# Altium project Keda.PrjPcb
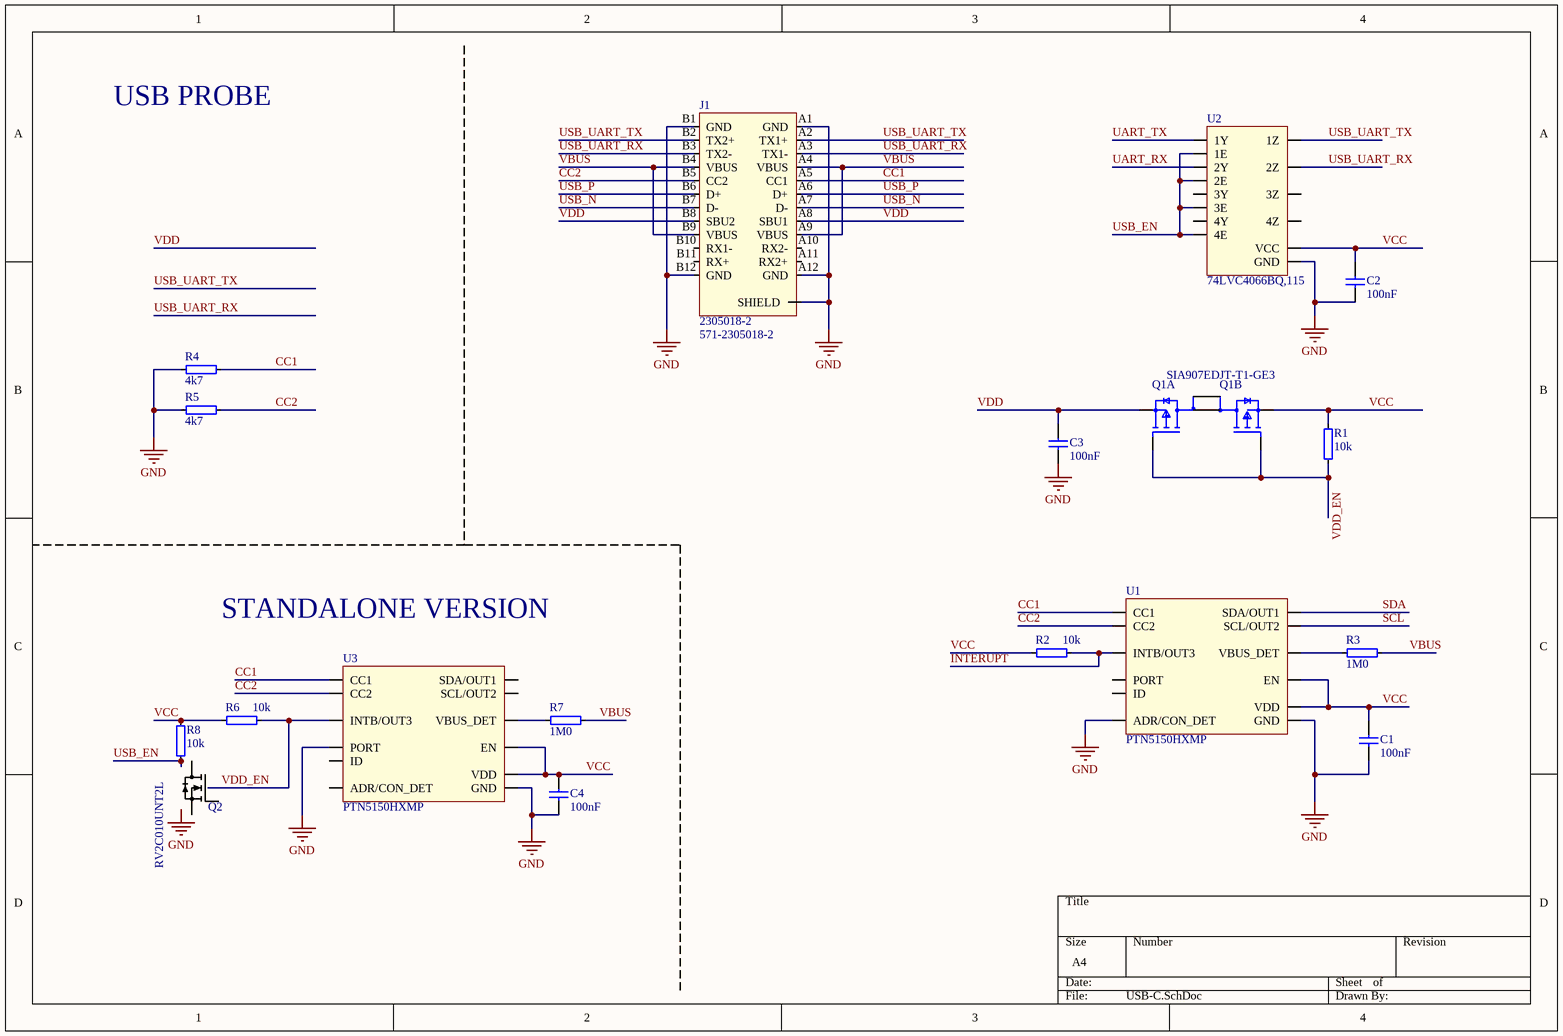
[diagram p0: USB-C.SchDoc]
3 sheets, 60 parts. Net scope: flat (ports and power ports of the same name join across sheets).
Board file: FPC.PcbDoc
Sheets:
  USB-C.SchDoc
  e-ink_display.SchDoc
  LTC3554.SchDoc

## Sheet USB-C.SchDoc
size A4; SheetNumber: 1; SheetTotal: 4

### Parts
C1  100nF  [CAPC0603X03L_C]
C2  100nF  [CAPC0603X03L_C]
C3  100nF  [CAPC0603X03L_C]
C4  100nF  [CAPC0603X03L_C]
J1  2305018-2  Supplier Part Number 1: 571-2305018-2  [2305018-2]
Q1  SIA907EDJT-T1-GE3  [FP-C-07431-DUAL-MFG]  (parts A,B of 2)
Q2  RV2C010UNT2L  [DFN65P100X40-3L]
R1  10k  [RESC0603X03L_C]
R2  10k  [RESC0603X03L_C]
R3  1M0  [RESC0603X03L_C]
R4  4k7  [RESC0603X03L_C]
R5  4k7  [RESC0603X03L_C]
R6  10k  [RESC0603X03L_C]
R7  1M0  [RESC0603X03L_C]
R8  10k  [RESC0603X03L_C]
U1  PTN5150HXMP  [PTN5150HXMP]
U2  74LVC4066BQ,115  [74LVC4066BQ,115]
U3  PTN5150HXMP  [PTN5150HXMP]

### Nets
GND: C1.1 C2.1 C3.1 C4.1 J1.A1(GND) J1.A12(GND) J1.B1(GND) J1.B12(GND) J1.SH1(SHIELD) R4.1 R5.1 U1.P5(ADR/CON_DET) U1.P10(GND) U2.P7(GND) U3.P3(PORT) U3.P10(GND)
CC1: J1.A5(CC1) R4.2 U1.P1(CC1) U3.P1(CC1)
CC2: J1.B5(CC2) R5.2 U1.P2(CC2) U3.P2(CC2)
INTERUPT: R2.2 U1.P6(INTB/OUT3)
SCL: U1.P8(SCL/OUT2)
SDA: U1.P7(SDA/OUT1)
UART_RX: U2.P4(2Y)
UART_TX: U2.P1(1Y)
USB_EN: R8.1 U2.P5(2E) U2.P6(3E) U2.P12(4E) U2.P13(1E)
USB_N: J1.A7(D-) J1.B7(D-)
USB_P: J1.A6(D+) J1.B6(D+)
USB_UART_RX: J1.A3(TX1-) J1.B3(TX2-) U2.P3(2Z)
USB_UART_TX: J1.A2(TX1+) J1.B2(TX2+) U2.P2(1Z)
VBUS: J1.A4(VBUS) J1.A9(VBUS) J1.B4(VBUS) J1.B9(VBUS) R3.2 R7.2
VCC: C1.2 C2.2 C4.2 Q1.4(S2) R1.2 R2.1 R6.1 R8.2 U1.P11(EN) U1.P12(VDD) U2.P14(VCC) U3.P11(EN) U3.P12(VDD)
VDD: C3.2 J1.A8(SBU1) J1.B8(SBU2) Q1.1(S1)
VDD_EN: Q1.2(G1) Q1.5(G2) R1.1 R6.2 U3.P6(INTB/OUT3)
NetQ1_3: Q1.3(D2) Q1.6(D1)
NetQ1_7: Q1.7(D1) Q1.8(D2)
NetR3_1: R3.1 U1.P4(VBUS_DET)
NetR7_1: R7.1 U3.P4(VBUS_DET)

Not connected (* = marked no-connect by the designer): J1 A10(RX2-) A11(RX2+) B10(RX1-) B11(RX+); Q2 1(G) 2(S) 3(D); U1 P3(PORT) P9(ID); U2 P8(3Y) P9(3Z) P10(4Z) P11(4Y); U3 P5(ADR/CON_DET) P7(SDA/OUT1) P8(SCL/OUT2) P9(ID)

### Notes on the sheet
- USB PROBE
- STANDALONE VERSION
- Labels drawn without touching a wire or pin: GND

### Library data of the parts
C1-C4 = C0201-100n: Capacitor, X5R, ±10%; Manufacturer: N.A.; Part number IPS: 00000001248, 00000002505; Note: 16V; Pad Count: 2; Part Number: C0201-100n; Manufacturer Part Number: N.A.; ComponentLink1URL: N.A.; ComponentLink1Description: Datasheet; ComponentLink2URL: N.A.; ComponentLink2Description: Supplier link; HelpURL: N.A.; Footprint Doc: 0201; LatestRevisionDate: 2017-11-09; Published: 2014-11-13; Value: 100nF; Artikkelnr Noca: N.A.; Supplier 1: N.A.; Supplier Part Number 1: N.A.; Supplier 2: N.A.; Supplier Part Number 2: N.A.; Component Class: Capacitors; PartId: 100200078
J1 = 2305018-2: Usb 3.1 Type C, 10GBPS, Receptacle, Rigusb Connectors Usb Type C, Rec IPX8 on Board Dual SMT; pin to pad: SH1>SH1+SH2+SH3+SH4+SH5+SH6; Manufacturer: TE Connectivity AMP; Number of Contacts: 24; Number of Ports: 1; Current Rating: 1.25A; Voltage Rating: 30V; Shielding: Shielded; Ratings: Waterproof; Supplier 1: Mouser; Manufacturer Part Number: 2305018-2; RoHS: Yes; Category: USB Connectors; Stock 1: 85836; Pricing 1: 1=3.00000, 10=2.52000, 50=2.52000, 100=2.40000, 250=2.18000, 800=1.85000, 1000=1.85000, 2400=1.77000, 4800=1.71000, 10000=1.77000 (USD); Mount: Surface Mount,Through Hole; Contact Plating: Gold; Insulation Color: Black; Min Operating Temperature: -40°C; Max Operating Temperature: 85°C; Connector Type: USB; Packaging: Tape and Reel; Gender: Receptacle; Termination: Solder; Flammability Rating: UL94 V-0; RoHS Compliant: Yes; ComponentLink1URL: http://www.farnell.com/datasheets/2611889.pdf?src-supplier=Farnell; ComponentLink1Description: http://www.farnell.com/datasheets/2611889.pdf?src-supplier=Farnell; ComponentLink2URL: https://www.te.com/commerce/DocumentDelivery/DDEController?Action=srchrtrv&DocNm=2305018&DocType=Customer+Drawing&DocLang=English&src-supplier=Digi-Key; ComponentLink2Description: https://www.te.com/commerce/DocumentDelivery/DDEController?Action=srchrtrv&DocNm=2305018&DocType=Customer+Drawing&DocLang=English&src-supplier=Digi-Key; ComponentLink3URL: http://www.farnell.com/datasheets/2611889.pdf?src-supplier=Newark; ComponentLink3Description: http://www.farnell.com/datasheets/2611889.pdf?src-supplier=Newark
Q1 = SIA907EDJT-T1-GE3: SiA907EDJT Series Dual P Channel 20 V 0.057 Ohm 7.8 W Mosfet - PowerPAK SC-70-6L; Manufacturer: Vishay Siliconix; Rds On Max: 57mR; Rise Time: 10ns; Drain to Source Voltage (Vdss): 20V; Continuous Drain Current (ID): 4.5A; Max Power Dissipation: 7.8W; Gate to Source Voltage (Vgs): 12V; Turn-Off Delay Time: 30ns; Number of Elements: 2; Power Dissipation: 1.9W; Turn-On Delay Time: 5ns; Drain to Source Breakdown Voltage: -20V; Polarity: P-CHANNEL; Supplier 1: Mouser; Manufacturer Part Number: SIA907EDJT-T1-GE3; RoHS: Yes; Category: MOSFETs; Stock 1: 2602; Pricing 1: 1=0.57000, 10=0.49500, 50=0.49500, 100=0.37000, 500=0.29100, 1000=0.22500, 3000=0.20400, 6000=0.19100, 9000=0.18500, 10000=0.18500 (USD); Mount: Surface Mount; Number of Pins: 6; Weight: 0.000988oz; Min Operating Temperature: -55°C; Max Operating Temperature: 150°C; Packaging: Tape and Reel; Package Quantity: 3000; Drain to Source Resistance: 57mR; Fall Time: 10ns; Number of Channels: 2; On-State Resistance: 57mR; Element Configuration: Dual; Series: TrenchFET®; Drain-source On Resistance-Max: 57mR; Radiation Hardening: No; Lead Free: Contains Lead; RoHS Compliant: Yes; ComponentLink1URL: https://datasheet.ciiva.com/4444/sia907edjt-223688-4444605.pdf?src-supplier=Mouser; ComponentLink1Description: https://datasheet.ciiva.com/4444/sia907edjt-223688-4444605.pdf?src-supplier=Mouser; ComponentLink2URL: https://datasheet.ciiva.com/30021/sia907edjt-30021591.pdf?src-supplier=Avnet; ComponentLink2Description: https://datasheet.ciiva.com/30021/sia907edjt-30021591.pdf?src-supplier=Avnet; Supplier Part Number 1: 78-SIA907EDJT-T1-GE3
Q2 = RV2C010UNT2L: MOSFET Transistor, N Channel, 1 A, 20 V, 0.34 ohm, 4.5 V, 1 V RoHS Compliant: Yes; Manufacturer: Rohm; Drain to Source Voltage (Vdss): 20V; Continuous Drain Current (ID): 1A; Rds On Max: 470mR; Input Capacitance: 40pF; Max Power Dissipation: 400mW; Threshold Voltage: 1V; Resistance: 0.34R; Supplier 1: Mouser; Manufacturer Part Number: RV2C010UNT2L; RoHS: Yes; Category: MOSFETs; Stock 1: 3031; Pricing 1: 1=0.39000, 10=0.25100, 50=0.25100, 100=0.16500, 500=0.10900, 1000=0.08400, 2500=0.07700, 10000=0.07700 (USD); Mount: Surface Mount; Number of Pins: 1006; Max Operating Temperature: 150°C; Packaging: Cut Tape; REACH SVHC: No SVHC; RoHS Compliant: Yes; ComponentLink1URL: http://www.farnell.com/datasheets/1945594.pdf?src-supplier=Farnell; ComponentLink1Description: http://www.farnell.com/datasheets/1945594.pdf?src-supplier=Farnell; ComponentLink2URL: http://www.mouser.com/ds/2/348/rv2c010un-e-1139137.pdf?src-supplier=Mouser; ComponentLink2Description: http://www.mouser.com/ds/2/348/rv2c010un-e-1139137.pdf?src-supplier=Mouser; ComponentLink3URL: http://rohmfs.rohm.com/en/techdata_basic/transistor/taping/VML1006_T2L_taping.pdf?src-supplier=Digi-Key; ComponentLink3Description: http://rohmfs.rohm.com/en/techdata_basic/transistor/taping/VML1006_T2L_taping.pdf?src-supplier=Digi-Key; ComponentLink4URL: http://www.rohm.com/web/global/datasheet/RV2C010UN/rv2c010un-e?src-supplier=Digi-Key; ComponentLink4Description: http://www.rohm.com/web/global/datasheet/RV2C010UN/rv2c010un-e?src-supplier=Digi-Key; ComponentLink5URL: http://rohmfs.rohm.com/en/products/databook/datasheet/discrete/transistor/mosfet/rv2c010unt2l.pdf?src-supplier=Avnet; ComponentLink5Description: http://rohmfs.rohm.com/en/products/databook/datasheet/discrete/transistor/mosfet/rv2c010unt2l.pdf?src-supplier=Avnet; ComponentLink6URL: http://www.farnell.com/datasheets/1945594.pdf?src-supplier=Element14; ComponentLink6Description: http://www.farnell.com/datasheets/1945594.pdf?src-supplier=Element14; Supplier Part Number 1: 755-RV2C010UNT2L
R1 R2 R6 R8 = R0201-10k: Resistor, ±1%, 0.05W; Manufacturer: N.A.; Part number IPS: 00000001255; Note: Chip Res 1%; Pad Count: 2; Part Number: R0201-10k; Manufacturer Part Number: N.A.; ComponentLink1URL: N.A.; ComponentLink1Description: Datasheet; ComponentLink2URL: N.A.; ComponentLink2Description: Supplier link; HelpURL: N.A.; Footprint Doc: 0201; LatestRevisionDate: 2014-11-13; Published: 2014-11-13; Value: 10k; Artikkelnr Noca: N.A.; Supplier 1: N.A.; Supplier Part Number 1: N.A.; Supplier 2: N.A.; Supplier Part Number 2: N.A.; Component Class: Resistors; PartId: 100100065
R3 R7 = R0201-1M0: Resistor, ±1%, 0.05W; Manufacturer: N.A.; Part number IPS: 00000001418; Note: Chip Res 1%; Pad Count: 2; Part Number: R0201-1M0; Manufacturer Part Number: N.A.; Footprint Doc: 0201; LatestRevisionDate: 2014-11-13; Published: 2014-11-13; Value: 1M0; Artikkelnr Noca: N.A.; ComponentLink1URL: N.A.; ComponentLink1Description: Datasheet; ComponentLink2URL: N.A.; ComponentLink2Description: Supplier link; HelpURL: N.A.; Supplier 1: N.A.; Supplier Part Number 1: N.A.; Supplier 2: N.A.; Supplier Part Number 2: N.A.; Component Class: Resistors; PartId: 100100093
R4 R5 = R0201-4k7: Resistor, ±1%, 0.05W; Manufacturer: N.A.; Part number IPS: 00000001706; Note: Chip Res 1%; Pad Count: 2; Part Number: R0201-4k7; Manufacturer Part Number: N.A.; Footprint Doc: 0201; LatestRevisionDate: 2014-11-13; Published: 2014-11-13; Value: 4k7; Artikkelnr Noca: N.A.; ComponentLink1URL: N.A.; ComponentLink1Description: Datasheet; ComponentLink2URL: N.A.; ComponentLink2Description: Supplier link; HelpURL: N.A.; Supplier 1: N.A.; Supplier Part Number 1: N.A.; Supplier 2: N.A.; Supplier Part Number 2: N.A.; Component Class: Resistors; PartId: 100100061
U1 U3 = PTN5150HXMP: Usb Interface IC PTN5150HX/X2QFN12/REEL 13" Q2/; Manufacturer: NXP Semiconductors; Supplier 1: Mouser; Manufacturer Part Number: PTN5150HXMP; RoHS: Yes; Category: Integrated Circuits (ICs); Stock 1: 6997; Pricing 1: 1=1.34000, 10=1.21000, 25=1.15000, 50=1.15000, 100=0.93900, 250=0.87800, 500=0.77600, 1000=0.77000, 10000=0.77000 (USD); Number of Pins: 12; Min Operating Temperature: -40°C; Max Operating Temperature: 85°C; Packaging: Tape and Reel; Interface: USB; ComponentLink1URL: https://www.nxp.com/docs/en/data-sheet/PTN5150.pdf?src-supplier=Digi-Key; ComponentLink1Description: https://www.nxp.com/docs/en/data-sheet/PTN5150.pdf?src-supplier=Digi-Key; ComponentLink2URL: http://www.farnell.com/datasheets/2615733.pdf?src-supplier=Newark; ComponentLink2Description: http://www.farnell.com/datasheets/2615733.pdf?src-supplier=Newark; Supplier Part Number 1: 771-PTN5150HXMP
U2 = 74LVC4066BQ,115: 74LVC Series 5.5 V Quad Bilateral Switch - DHVQFN-14; pin to pad: P7>P7+P15; Manufacturer: Nexperia; Supplier 1: Mouser; Manufacturer Part Number: 74LVC4066BQ,115; RoHS: Yes; Category: Decoders and Multiplexers; Stock 1: 3323; Pricing 1: 1=0.67000, 10=0.56700, 50=0.56700, 100=0.44600, 1000=0.29700, 10000=0.28800 (USD); ComponentLink1URL: https://assets.nexperia.com/documents/data-sheet/74LVC4066.pdf?src-supplier=Digi-Key; ComponentLink1Description: https://assets.nexperia.com/documents/data-sheet/74LVC4066.pdf?src-supplier=Digi-Key; Supplier Part Number 1: 771-LVC4066BQ115

## Sheet e-ink_display.SchDoc
size A4; SheetNumber: 2; SheetTotal: 4
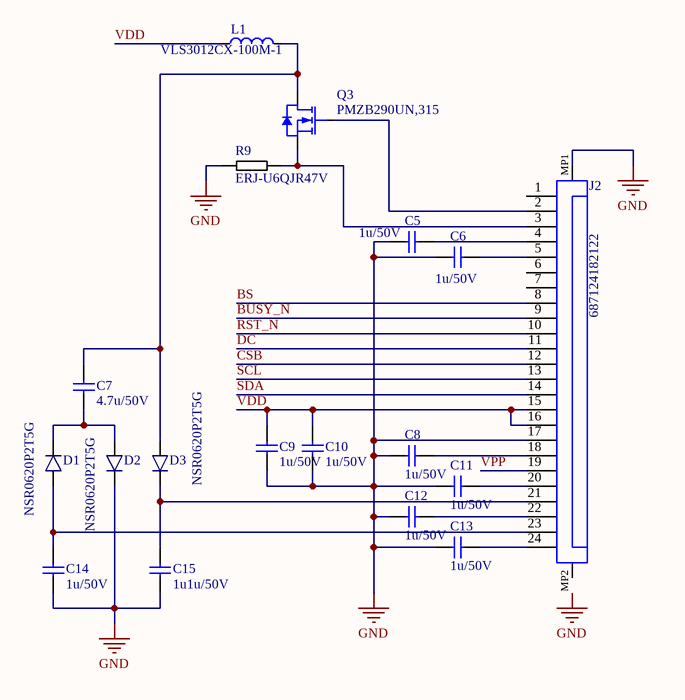
[diagram p1: e-ink_display.SchDoc]

### Parts
C5  1u/50V  [CAPC1005X04L]
C6  1u/50V  [CAPC1005X04L]
C7  4.7u/50V  [CAPC1005X04L]
C8  1u/50V  [CAPC1005X04L]
C9  1u/50V  [CAPC1005X04L]
C10  1u/50V  [CAPC1005X04L]
C11  1u/50V  [CAPC1005X04L]
C12  1u/50V  [CAPC1005X04L]
C13  1u/50V  [CAPC1005X04L]
C14  1u/50V  [CAPC1005X04L]
C15  1u1u/50V  [CAPC1005X04L]
D1  NSR0620P2T5G  [SODFL100X40-2N]
D2  NSR0620P2T5G  [SODFL100X40-2N]
D3  NSR0620P2T5G  [SODFL100X40-2N]
J2  687124182122  [687124182122]
L1  VLS3012CX-100M-1  [VLS3012CX-100M-1]
Q3  PMZB290UN,315  [NXP-SOT883B_N]
R9  ERJ-U6QJR47V  [R0805]

### Nets
GND: C5.1 C6.1 C8.1 C9.1 C10.1 C11.1 C12.1 C13.1 C14.1 C15.1 D2.1(C) J2.17 J2.MP1 R9.1
BS: J2.8
BUSY_N: J2.9
CSB: J2.12
DC: J2.11
RST_N: J2.10
SCL: J2.13
SDA: J2.14
VDD: C9.2 C10.2 J2.15 J2.16 L1.1
VPP: J2.19
NetC5_2: C5.2 J2.4
NetC6_2: C6.2 J2.5
NetC7_1: C7.1 D1.1(C) D2.2(A)
NetC7_2: C7.2 D3.2(A) L1.2 Q3.3(D)
NetC8_2: C8.2 J2.18
NetC11_2: C11.2 J2.20
NetC12_2: C12.2 J2.22
NetC13_2: C13.2 J2.24
NetC14_2: C14.2 D1.2(A) J2.23
NetC15_2: C15.2 D3.1(C) J2.21
NetJ2_2: J2.2 Q3.1(G)
NetJ2_3: J2.3 Q3.2(S) R9.1

Not connected (* = marked no-connect by the designer): J2 1 6 7 MP2

### Notes on the sheet
- Labels drawn without touching a wire or pin: GND

### Library data of the parts
C5-C15 = C0402
D1-D3 = NSR0620P2T5G: 20V schottky barrier diode, Vf 350 mV @ 100 mA, Ir 2.0 µA @ 10 V, If 500 mA; Manufacturer: ON Semiconductor; Part number IPS: 00000009952; Note: N.A.; Artikkelnr Noca: 10029169; Pad Count: 2; Part Number: NSR0620P2T5G; Manufacturer Part Number: NSR0620P2T5G; LatestRevisionDate: 2016-07-07; Published: 2016-07-07; Value: NSR0620P2T5G; Footprint Doc: SOD-923; ComponentLink1URL: N.A.; ComponentLink1Description: Datasheet; ComponentLink2URL: N.A.; ComponentLink2Description: Supplier link; HelpURL: http://www.onsemi.com/pub_link/Collateral/NSR0620P2-D.PDF; Supplier 1: Digi-Key; Supplier Part Number 1: NSR0620P2T5GOSCT-ND; Supplier 2: N.A.; Supplier Part Number 2: N.A.; Component Class: Semiconductors; PartId: 101300131
J2 = 687124182122: WR-FPC SMT ZIF Horizontal Dual Contact, pitch 0.5mm, 24p; Manufacturer: Wurth Elektronik; Contact Resistance: 30mOhm; Pin Number: 24; Working Voltage: 50VAC; Rated Current: 0.5A; ComponentLink1Description: Manufacturer; ComponentLink1URL: http://www.we-online.de; ComponentLink2Description: Datasheet; ComponentLink2URL: https://katalog.we-online.com/em/datasheet/687124182122.pdf; Packaging: Tape and Reel; Pitch: 0.5mm; Published Date: March 2021; Mounting Technology: SMT; Operating Temperature: -25 to +85degC; Length: 14mm; Manufacturer Part Number: 687124182122; Type: Horizontal
L1 = VLS3012CX-100M-1: Inductor Power Shielded Wirewound 10uH 20% 1MHz Ferrite 1.12A 0.324Ohm DCR 1212 T/R; Manufacturer: TDK; Current Rating: 1.25A; Saturation Current: 1A; DC Resistance (DCR): 324mR; Supplier 1: Mouser; Manufacturer Part Number: VLS3012CX-100M-1; RoHS: Yes; Category: Fixed Inductors; Stock 1: 61514; Pricing 1: 1=0.42000, 10=0.27800, 50=0.27800, 100=0.23100, 1000=0.16700, 10000=0.13600 (USD); Mount: Surface Mount; Case/Package: Nonstandard; Core Material: Ferrite; Min Operating Temperature: -40°C; Max Operating Temperature: 105°C; Resistor Type: Wirewound; Packaging: Tape and Reel; Inductance: 10uH; Tolerance: 20%; Shielding: Shielded; Test Frequency: 1MHz; RoHS Compliant: Yes; ComponentLink1URL: https://product.tdk.com/info/en/catalog/datasheets/inductor_commercial_power_vls3012cx-1_en.pdf?src-supplier=Digi-Key; ComponentLink1Description: https://product.tdk.com/info/en/catalog/datasheets/inductor_commercial_power_vls3012cx-1_en.pdf?src-supplier=Digi-Key; Supplier Part Number 1: 810-VLS3012CX-100M-1
Q3 = PMZB290UN,315: PMZB290UN - 20 V, single N-channel Trench MOSFET; Manufacturer: NXP Semiconductors; Rise Time: 10ns; Continuous Drain Current (ID): 1A; Gate to Source Voltage (Vgs): 8V; Turn-On Delay Time: 4.5ns; Turn-Off Delay Time: 18.5ns; Fall Time: 5ns; Rds On Max: 380mR; Input Capacitance: 83pF; Max Dual Supply Voltage: 20V; Max Power Dissipation: 360mW; Supplier 1: Mouser; Manufacturer Part Number: PMZB290UN,315; RoHS: Yes; Category: MOSFETs; Case/Package: DFN; Number of Pins: 3; Min Operating Temperature: -55°C; Max Operating Temperature: 150°C; Package Quantity: 1; Packaging: Tape and Reel; Drain to Source Voltage (Vdss): 20V; Series: -; Radiation Hardening: No; RoHS Compliant: Yes; ComponentLink1URL: https://datasheet.ciiva.com/11165/pmzb290un-11165755.pdf?src-supplier=Avnet; ComponentLink1Description: https://datasheet.ciiva.com/11165/pmzb290un-11165755.pdf?src-supplier=Avnet; ComponentLink2URL: https://datasheet.ciiva.com/25647/pmzb290une-25647430.pdf?src-supplier=Digi-Key; ComponentLink2Description: https://datasheet.ciiva.com/25647/pmzb290une-25647430.pdf?src-supplier=Digi-Key; ComponentLink3URL: https://datasheet.ciiva.com/29742/pmzb290une-29742088.pdf?src-supplier=Digi-Key; ComponentLink3Description: https://datasheet.ciiva.com/29742/pmzb290une-29742088.pdf?src-supplier=Digi-Key; ComponentLink4URL: https://datasheet.ciiva.com/29742/pmzb290une-29742092.pdf?src-supplier=Digi-Key; ComponentLink4Description: https://datasheet.ciiva.com/29742/pmzb290une-29742092.pdf?src-supplier=Digi-Key; Supplier Part Number 1: 771-PMZB290UN,315
R9 = ERJ-U6QJR47V: Anti-Sulfurated Thick Film Chip Resistors, 0.47½, 5%, 0.25W; Manufacturer: Panasonic; Resistance: 470mR; Max Power Dissipation: 250mW; Temperature Coefficient: 150ppm/°C; Supplier 1: Mouser; Manufacturer Part Number: ERJ-U6QJR47V; RoHS: No; Category: Chip SMD Resistors; Stock 1: 10093; Pricing 1: 1=0.51000, 10=0.37200, 50=0.37200, 100=0.15500, 1000=0.07900, 10000=0.07000 (USD); Case/Package: 0805; Case Code (Imperial): 0805; Case Code (Metric): 2012; Min Operating Temperature: -55°C; Max Operating Temperature: 155°C; Features: Automotive AEC-Q200,Anti-Sulfur; Packaging: Cut Tape; Tolerance: 5%; Number of Terminations: 2; Resistor Type: Thick Film; ComponentLink1URL: https://industrial.panasonic.com/cdbs/www-data/pdf/RDP0000/AOA0000C334.pdf?src-supplier=Digi-Key; ComponentLink1Description: https://industrial.panasonic.com/cdbs/www-data/pdf/RDP0000/AOA0000C334.pdf?src-supplier=Digi-Key; Supplier Part Number 1: 667-ERJ-U6QJR47V

## Sheet LTC3554.SchDoc
size A4; SheetNumber: 3; SheetTotal: 3
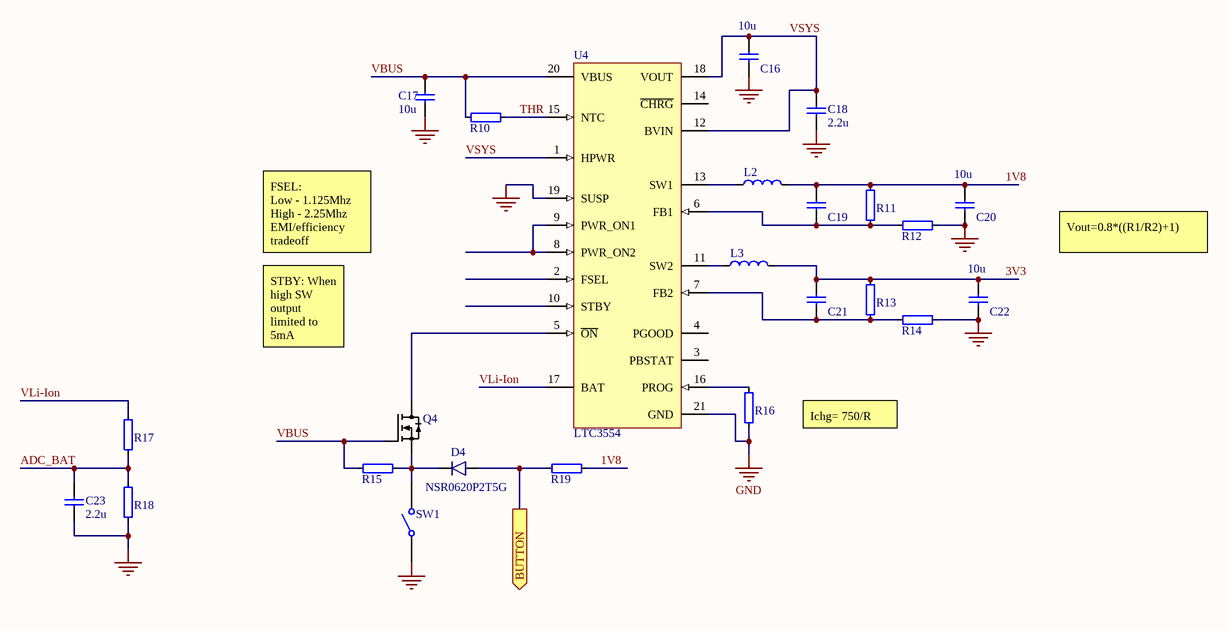
[diagram p2: LTC3554.SchDoc]

### Parts
C16  10u  [CAPC1608X06L]
C17  10u  [CAPC1608X06L]
C18  2.2u  [CAPC1005X04L]
C19  10p  [CAPC0603X03L_C]  (value not drawn)
C20  10u  [CAPC1608X06L]
C21  10p  [CAPC0603X03L_C]  (value not drawn)
C22  10u  [CAPC1608X06L]
C23  2.2u  [CAPC1005X04L]
D4  NSR0620P2T5G  [SODFL100X40-2N]
L2  LQM21DH100M70L  [FP-LQM21DH_70-MFG]  (value not drawn)
L3  PE-0805CLH4R7STS  [L0805]  (value not drawn)
Q4  RV2C010UNT2L  [DFN65P100X40-3L]  (value not drawn)
R10  R0201  [RESC0603X03L_C]  (value not drawn)
R11  1.5M  [RESC0603X03L_C]  (value not drawn)
R12  1.2M  [RESC0603X03L_C]  (value not drawn)
R13  1.5M  [RESC0603X03L_C]  (value not drawn)
R14  475k  [RESC0603X03L_C]  (value not drawn)
R15  10K  [RESC0603X03L_C]  (value not drawn)
R16  1.5k  [RESC0603X03L_C]  (value not drawn)
R17  1M  [RESC0603X03L_C]  (value not drawn)
R18  510k  [RESC0603X03L_C]  (value not drawn)
R19  10K  [RESC0603X03L_C]  (value not drawn)
SW1  434123050816  [434123050816]  (value not drawn)
U4  LTC3554  [LT-UD-20_L]

### Ports
BUTTON (out)

### Nets
GND: C16.1 C17.1 C18.1 C20.1 C22.1 C23.1 R12.1 R14.1 R16.1 R18.2 SW1.1 U4.19(SUSP) U4.21(GND)
1V8: C19.2 C20.2 L2.2 R11.2 R19.1
3V3: C21.2 C22.2 L3.2 R13.2
ADC_BAT: C23.2 R17.2 R18.1
THR: R10.1 U4.15(NTC)
VBUS: C17.2 Q4.1(G) R10.2 R15.2 U4.20(VBUS)
VLi-Ion: R17.1 U4.17(BAT)
VSYS: C16.2 C18.2 U4.1(HPWR) U4.12(BVIN) U4.18(VOUT)
NetC19_1: C19.1 R11.1 R12.2 U4.6(FB1)
NetC21_1: C21.1 R13.1 R14.2 U4.7(FB2)
NetD4_1: D4.1(C) Q4.2(S) R15.1 SW1.2
NetD4_2: D4.2(A) R19.2 ; port BUTTON
NetL2_1: L2.1 U4.13(SW1)
NetL3_1: L3.1 U4.11(SW2)
NetQ4_3: Q4.3(D) U4.5(~{ON})
NetR16_2: R16.2 U4.16(PROG)
NetU4_8: U4.8(PWR_ON2) U4.9(PWR_ON1)

Not connected (* = marked no-connect by the designer): U4 2(FSEL) 3(PBSTAT) 4(PGOOD) 10(STBY) 14(~{CHRG})

### Notes on the sheet
- FSEL:
  Low - 1.125Mhz
  High - 2.25Mhz
  EMI/efficiency tradeoff
- Vout=0.8*((R1/R2)+1)
- STBY: When high SW output limited to 5mA
- Ichg= 750/R

### Library data of the parts
C16 C17 C20 C22 = C0603
C18 C23 = C0402
C19 C21 = C0201
D4 = NSR0620P2T5G: as D1 on sheet e-ink_display; Part Number: NSR0620P2T5G; Manufacturer Part Number: NSR0620P2T5G; LatestRevisionDate: 2016-07-07; Published: 2016-07-07; Value: NSR0620P2T5G; Footprint Doc: SOD-923; ComponentLink1URL: N.A.; ComponentLink1Description: Datasheet; ComponentLink2URL: N.A.; ComponentLink2Description: Supplier link; HelpURL: http://www.onsemi.com/pub_link/Collateral/NSR0620P2-D.PDF; Supplier 1: Digi-Key; Supplier Part Number 1: NSR0620P2T5GOSCT-ND; Supplier 2: N.A.; Supplier Part Number 2: N.A.; Component Class: Semiconductors; PartId: 101300131
L2 = LQM21DH100M70L: Inductor Power Chip Shielded Multi-Layer 10uH 20% 1MHz Ferrite 0.3A 0.845Ohm DCR 0805 Automotive T/R; Manufacturer: Murata; Supplier 1: Mouser; Manufacturer Part Number: LQM21DH100M70L; RoHS: No; Category: Fixed Inductors; Stock 1: 80712; Pricing 1: 1=0.27000, 10=0.18200, 50=0.18200, 100=0.15200, 1000=0.10900, 10000=0.09200 (USD); Supplier Part Number 1: 81-LQM21DH100M70L
L3 = PE-0805CLH4R7STS: wire wound chip inductor, 4, 700.00 nh, +/-20%, 25 mHz, RoHS; Manufacturer: Pulse; Supplier 1: Mouser; Manufacturer Part Number: PE-0805CLH4R7STS; RoHS: Yes; Category: Fixed Inductors; Stock 1: 20462; Pricing 1: 1=0.28000, 10=0.21900, 50=0.21900, 100=0.16500, 1000=0.12600, 10000=0.09100 (USD); Supplier Part Number 1: 673-PE-0805CLH4R7STS
Q4 = RV2C010UNT2L: as Q2 on sheet USB-C; Supplier 1: Mouser; Manufacturer Part Number: RV2C010UNT2L; RoHS: Yes; Category: MOSFETs; Stock 1: 3031; Pricing 1: 1=0.39000, 10=0.25100, 50=0.25100, 100=0.16500, 500=0.10900, 1000=0.08400, 2500=0.07700, 10000=0.07700 (USD); Mount: Surface Mount; Number of Pins: 1006; Max Operating Temperature: 150°C; Packaging: Cut Tape; REACH SVHC: No SVHC; RoHS Compliant: Yes; ComponentLink1URL: http://www.farnell.com/datasheets/1945594.pdf?src-supplier=Farnell; ComponentLink1Description: http://www.farnell.com/datasheets/1945594.pdf?src-supplier=Farnell; ComponentLink2URL: http://www.mouser.com/ds/2/348/rv2c010un-e-1139137.pdf?src-supplier=Mouser; ComponentLink2Description: http://www.mouser.com/ds/2/348/rv2c010un-e-1139137.pdf?src-supplier=Mouser; ComponentLink3URL: http://rohmfs.rohm.com/en/techdata_basic/transistor/taping/VML1006_T2L_taping.pdf?src-supplier=Digi-Key; ComponentLink3Description: http://rohmfs.rohm.com/en/techdata_basic/transistor/taping/VML1006_T2L_taping.pdf?src-supplier=Digi-Key; ComponentLink4URL: http://www.rohm.com/web/global/datasheet/RV2C010UN/rv2c010un-e?src-supplier=Digi-Key; ComponentLink4Description: http://www.rohm.com/web/global/datasheet/RV2C010UN/rv2c010un-e?src-supplier=Digi-Key; ComponentLink5URL: http://rohmfs.rohm.com/en/products/databook/datasheet/discrete/transistor/mosfet/rv2c010unt2l.pdf?src-supplier=Avnet; ComponentLink5Description: http://rohmfs.rohm.com/en/products/databook/datasheet/discrete/transistor/mosfet/rv2c010unt2l.pdf?src-supplier=Avnet; ComponentLink6URL: http://www.farnell.com/datasheets/1945594.pdf?src-supplier=Element14; ComponentLink6Description: http://www.farnell.com/datasheets/1945594.pdf?src-supplier=Element14; Supplier Part Number 1: 755-RV2C010UNT2L
R11-R19 = R0201
SW1 = 434123050816: Switch Tactile Spst-no 0.05A 12V; Manufacturer: Wurth Electronics; Mechanical Life: 50000Cycles; Actuator Material: Polymer,Liquid Crystal Polymer; Operating Force: 160gf; Contact Resistance: 100mR; Contact Current Rating: 50mA; Illumination Type: Non-Illuminated,Illuminated; Throw Configuration: SPST; Switch Travel: 0.25mm; Switch Function: Off-Mom; Actuator Length: 1.5mm; Supplier 1: Mouser; Manufacturer Part Number: 434123050816; RoHS: Yes; Category: Tactile Switches; Stock 1: 2599; Pricing 1: 1=0.54000, 10=0.54000, 50=0.54000, 100=0.54000, 750=0.43300, 1000=0.43300, 1500=0.36700, 10000=0.36700 (USD); Mount: Surface Mount; Contact Material: Stainless Steel,Steel; Min Operating Temperature: -40°C; Max Operating Temperature: 85°C; Current Rating: 50mA; Packaging: Tape and Reel; Termination: Solder; Insulation Resistance: 100MR; Series: WS-TASV; Contact Type: 1 maker; Length: 7.2mm; Width: 3.5mm; Height: 5mm; REACH SVHC: No SVHC; Lead Free: Lead Free; RoHS Compliant: Yes; ComponentLink1URL: https://datasheet.ciiva.com/1532/434123043816-1532528.pdf?src-supplier=Element14; ComponentLink1Description: https://datasheet.ciiva.com/1532/434123043816-1532528.pdf?src-supplier=Element14; ComponentLink2URL: https://datasheet.ciiva.com/30466/0900766b8126b636-30466780.pdf?src-supplier=RSComponents; ComponentLink2Description: https://datasheet.ciiva.com/30466/0900766b8126b636-30466780.pdf?src-supplier=RSComponents; ComponentLink3URL: https://datasheet.ciiva.com/29123/711760-da-01-en-taster-434123050816-29123824.pdf?src-supplier=Conrad; ComponentLink3Description: https://datasheet.ciiva.com/29123/711760-da-01-en-taster-434123050816-29123824.pdf?src-supplier=Conrad; ComponentLink4URL: https://datasheet.ciiva.com/1633/434123043816-1633968.pdf?src-supplier=Farnell; ComponentLink4Description: https://datasheet.ciiva.com/1633/434123043816-1633968.pdf?src-supplier=Farnell; ComponentLink5URL: https://datasheet.ciiva.com/22695/434123043816-22695550.pdf?src-supplier=Element14; ComponentLink5Description: https://datasheet.ciiva.com/22695/434123043816-22695550.pdf?src-supplier=Element14; Supplier Part Number 1: 710-434123050816
U4 = LTC3554EUD#PBF: IC USB POWER MANAGER 20UTQFN; Manufacturer: Analog Devices / Linear Technology; Operating Supply Current: 10uA; Max Input Voltage: 5.5V; Min Input Voltage: 4.35V; Number of Cells: 1; Number of Outputs: 2; Supplier 1: Mouser; Manufacturer Part Number: LTC3554EUD#PBF; RoHS: Yes; Category: Power Management ICs; Stock 1: 1043; Pricing 1: 1=6.36000, 10=5.75000, 50=5.48000, 100=4.76000, 1000=4.13000, 10000=3.77000 (USD); Case/Package: QFN; Number of Pins: 20; Min Operating Temperature: -40°C; Max Operating Temperature: 85°C; Package Quantity: 121; Packaging: Rail/Tube; Series: PowerPath™; Operating Supply Voltage: 5.5V; Length: 3mm; Radiation Hardening: No; RoHS Compliant: Yes; REACH SVHC: No SVHC; ComponentLink1URL: https://datasheet.ciiva.com/1644/1726404-1644763.pdf?src-supplier=Newark; ComponentLink1Description: https://datasheet.ciiva.com/1644/1726404-1644763.pdf?src-supplier=Newark; ComponentLink2URL: https://datasheet.ciiva.com/1512/1712336-1512448.pdf?src-supplier=Element14; ComponentLink2Description: https://datasheet.ciiva.com/1512/1712336-1512448.pdf?src-supplier=Element14; ComponentLink3URL: https://datasheet.ciiva.com/15104/getdatasheetpartid-447198-15104413.pdf?src-supplier=Verical; ComponentLink3Description: https://datasheet.ciiva.com/15104/getdatasheetpartid-447198-15104413.pdf?src-supplier=Verical; ComponentLink4URL: https://datasheet.ciiva.com/1964/27687-1964823.pdf?src-supplier=Digi-Key; ComponentLink4Description: https://datasheet.ciiva.com/1964/27687-1964823.pdf?src-supplier=Digi-Key; Supplier Part Number 1: 584-LTC3554EUD#PBF

## Nets that join several sheets
GND: USB-C (16 pins), e-ink_display (14 pins), LTC3554 (13 pins)